# Altium project BLDC_DRIVER.PrjPcb
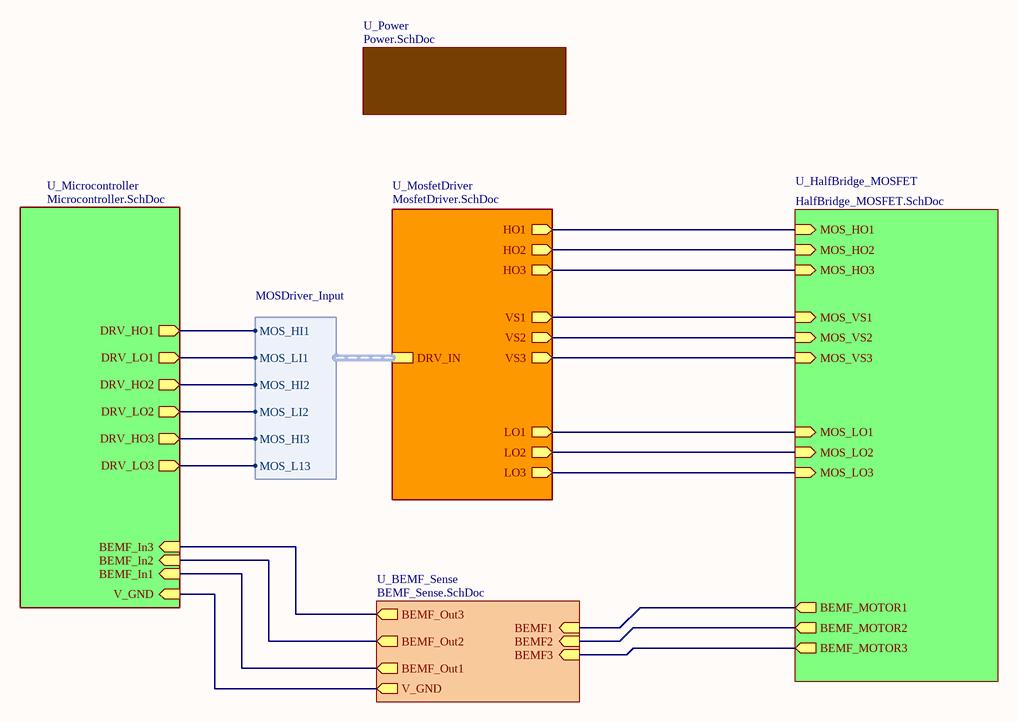
[diagram p0: TopLevel.SchDoc]
6 sheets, 81 parts. Net scope: hierarchical (ports join the sheet entries above them; power ports are global).
Board file: PCB1.PcbDoc
Sheets:
  TopLevel.SchDoc
    U_Microcontroller = Microcontroller.SchDoc
    U_MosfetDriver = MosfetDriver.SchDoc
    U_BEMF_Sense = BEMF_Sense.SchDoc
    U_Power = Power.SchDoc
    U_HalfBridge_MOSFET = HalfBridge_MOSFET.SchDoc

## Sheet TopLevel.SchDoc: TOP LEVEL
size A4

### Sub-sheets
U_BEMF_Sense = BEMF_Sense.SchDoc: BEMF_Out3 (out), BEMF_Out1 (out), BEMF_Out2 (out), BEMF1 (in), BEMF2 (in), BEMF3 (in), V_GND (out)
U_HalfBridge_MOSFET = HalfBridge_MOSFET.SchDoc: MOS_HO1 (in), MOS_VS1 (in), MOS_LO1 (in), BEMF_MOTOR1 (out), MOS_HO2 (in), MOS_VS2 (in), MOS_LO2 (in), BEMF_MOTOR2 (out), MOS_HO3 (in), MOS_VS3 (in), MOS_LO3 (in), BEMF_MOTOR3 (out)
U_Microcontroller = Microcontroller.SchDoc: DRV_HO1 (out), DRV_LO2 (out), DRV_LO1 (out), DRV_HO2 (out), DRV_LO3 (out), DRV_HO3 (out), BEMF_In3 (in), BEMF_In2 (in), BEMF_In1 (in), V_GND (in)
U_MosfetDriver = MosfetDriver.SchDoc: DRV_IN (harness MOSDriver_Input), LO1 (out), LO2 (out), LO3 (out), VS3 (out), VS2 (out), VS1 (out), HO3 (out), HO2 (out), HO1 (out)
U_Power = Power.SchDoc: no entries

### Harnesses
MOSDriver_Input: MOS_HI1, MOS_HI2, MOS_HI3, MOS_LI1, MOS_LI2, MOS_L13

### Nets
BEMF1: sheet U_MosfetDriver/VS1, sheet U_BEMF_Sense/BEMF1, sheet U_HalfBridge_MOSFET/MOS_VS1, sheet U_HalfBridge_MOSFET/BEMF_MOTOR1
BEMF2: sheet U_MosfetDriver/VS2, sheet U_BEMF_Sense/BEMF2, sheet U_HalfBridge_MOSFET/MOS_VS2, sheet U_HalfBridge_MOSFET/BEMF_MOTOR2
BEMF3: sheet U_MosfetDriver/VS3, sheet U_BEMF_Sense/BEMF3, sheet U_HalfBridge_MOSFET/MOS_VS3, sheet U_HalfBridge_MOSFET/BEMF_MOTOR3
BEMF_Out1: sheet U_Microcontroller/BEMF_In1, sheet U_BEMF_Sense/BEMF_Out1
BEMF_Out2: sheet U_Microcontroller/BEMF_In2, sheet U_BEMF_Sense/BEMF_Out2
BEMF_Out3: sheet U_Microcontroller/BEMF_In3, sheet U_BEMF_Sense/BEMF_Out3
HIN1: sheet U_Microcontroller/DRV_HO1, sheet U_MosfetDriver/DRV_IN.MOS_HI1
HIN2: sheet U_Microcontroller/DRV_HO2, sheet U_MosfetDriver/DRV_IN.MOS_HI2
HIN3: sheet U_Microcontroller/DRV_HO3, sheet U_MosfetDriver/DRV_IN.MOS_HI3
LIN1: sheet U_Microcontroller/DRV_LO1, sheet U_MosfetDriver/DRV_IN.MOS_LI1
LIN2: sheet U_Microcontroller/DRV_LO2, sheet U_MosfetDriver/DRV_IN.MOS_LI2
LIN3: sheet U_Microcontroller/DRV_LO3, sheet U_MosfetDriver/DRV_IN.MOS_L13
VGND: sheet U_Microcontroller/V_GND, sheet U_BEMF_Sense/V_GND
NetIC1_5: sheet U_MosfetDriver/LO1, sheet U_HalfBridge_MOSFET/MOS_LO1
NetIC1_7: sheet U_MosfetDriver/HO1, sheet U_HalfBridge_MOSFET/MOS_HO1
NetIC2_5: sheet U_MosfetDriver/LO2, sheet U_HalfBridge_MOSFET/MOS_LO2
NetIC2_7: sheet U_MosfetDriver/HO2, sheet U_HalfBridge_MOSFET/MOS_HO2
NetIC3_5: sheet U_MosfetDriver/LO3, sheet U_HalfBridge_MOSFET/MOS_LO3
NetIC3_7: sheet U_MosfetDriver/HO3, sheet U_HalfBridge_MOSFET/MOS_HO3

### Notes on the sheet
- Title
- Size:
- Date:
- A4
- Number:
- Time:
- Revision:
- Sheet
- of
- File:

## Sheet Microcontroller.SchDoc
size A4
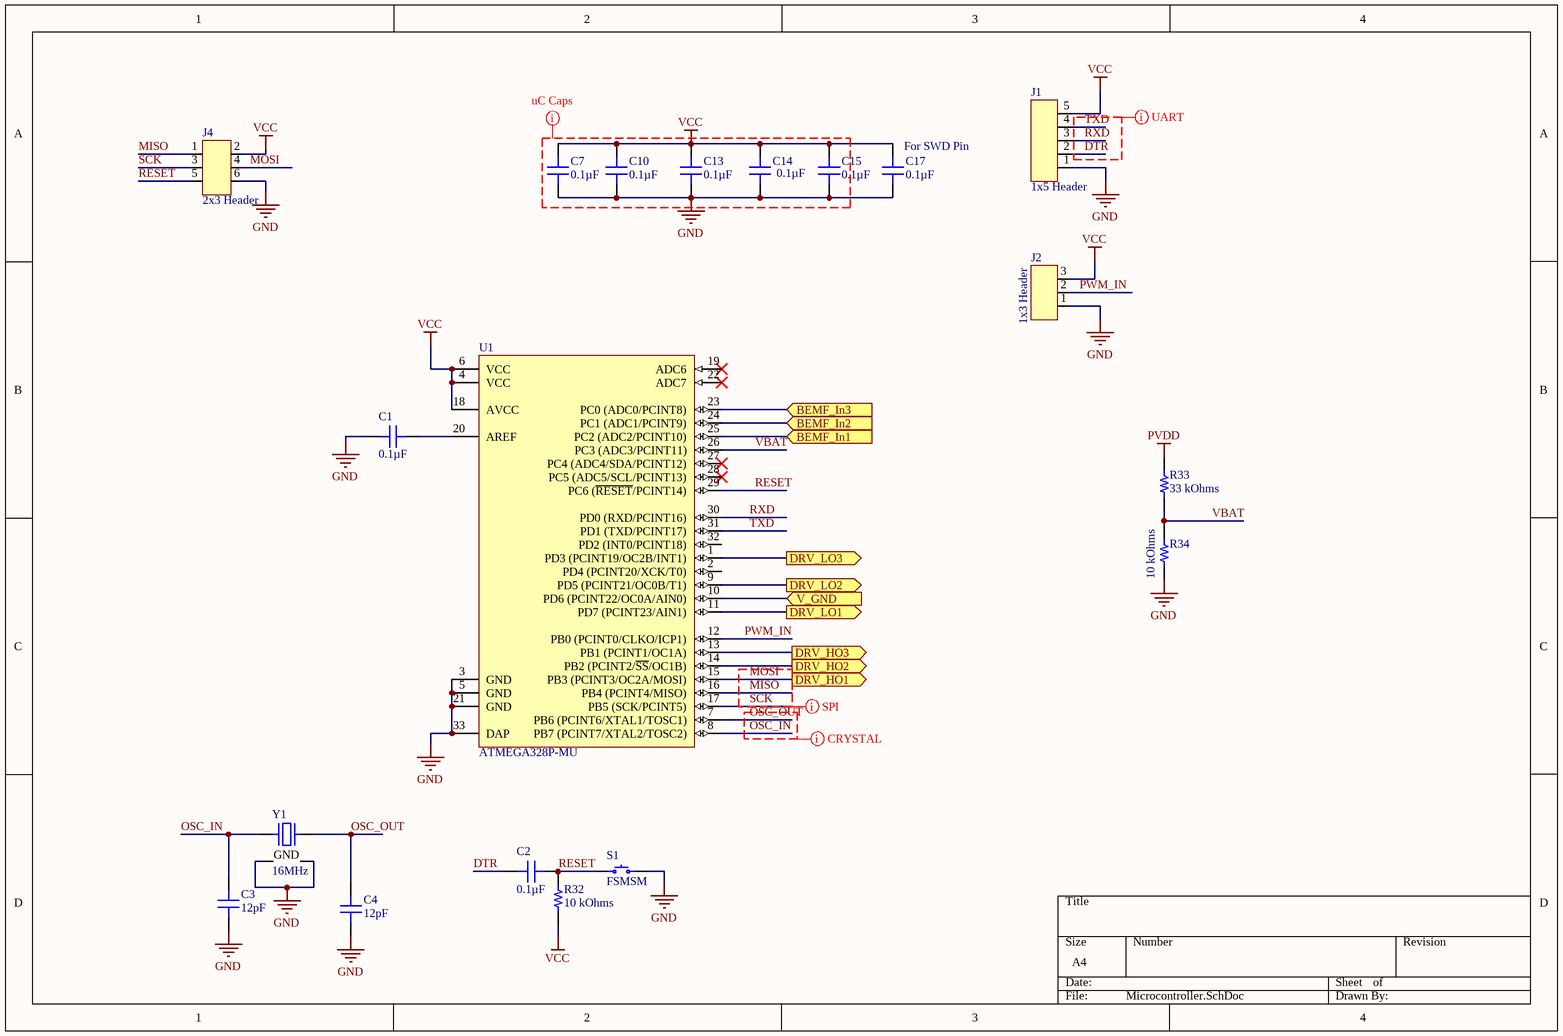
[diagram p1: Microcontroller.SchDoc]

### Parts
C1  0.1µF  [CAP 0603_1608]
C2  0.1µF  [CAP 0603_1608]
C3  12pF  [CAP 0402_1005]
C4  12pF  [CAP 0402_1005]
C7  0.1µF  [CAP 0603_1608]
C10  0.1µF  [CAP 0603_1608]
C13  0.1µF  [CAP 0603_1608]
C14  0.1µF  [CAP 0603_1608]
C15  0.1µF  [CAP 0603_1608]
C17  0.1µF  [CAP 0603_1608]
J1  1x5 Header  [1X5-HEADER]
J2  1x3 Header  [1x3Header]
J4  2x3 Header  [3x2 Header]
R32  10 kOhms  [RES 0805_2012]
R33  33 kOhms  [RES 0805_2012]
R34  10 kOhms  [RES 0805_2012]
S1  FSMSM  [TE FSMSMTR]
U1  ATMEGA328P-MU  [QFN50P500X500X100_HS-33N]
Y1  16MHz  [NDK NX2520SA]

### Ports
BEMF_In1 (in), BEMF_In2 (in), BEMF_In3 (in), DRV_HO1 (out), DRV_HO2 (out), DRV_HO3 (out), DRV_LO1 (out), DRV_LO2 (out), DRV_LO3 (out), V_GND (in)

### Nets
GND: C1.2 C3.1 C4.1 C7.1 C10.1 C13.1 C14.1 C15.1 C17.2 J1.1 J2.1 J4.6 R34.1 S1.2 U1.3(GND) U1.5(GND) U1.21(GND) U1.33(DAP) Y1.2(GND) Y1.4(GND)
PVDD: R33.2
VCC: C7.2 C10.2 C13.2 C14.2 C15.2 C17.1 J1.5 J2.3 J4.2 R32.2 U1.4(VCC) U1.6(VCC) U1.18(AVCC)
BEMF_Out1: U1.25(PC2_(ADC2/PCINT10)) ; port BEMF_In1
BEMF_Out2: U1.24(PC1_(ADC1/PCINT9)) ; port BEMF_In2
BEMF_Out3: U1.23(PC0_(ADC0/PCINT8)) ; port BEMF_In3
DTR: C2.2 J1.2
HIN2: U1.14(PB2_(PCINT2/~{SS}/OC1B)) ; port DRV_HO2
HIN3: U1.13(PB1_(PCINT1/OC1A)) ; port DRV_HO3
LIN1: U1.11(PD7_(PCINT23/AIN1)) ; port DRV_LO1
LIN2: U1.9(PD5_(PCINT21/OC0B/T1)) ; port DRV_LO2
LIN3: U1.1(PD3_(PCINT19/OC2B/INT1)) ; port DRV_LO3
MISO: J4.1 U1.16(PB4_(PCINT4/MISO))
MOSI: J4.4 U1.15(PB3_(PCINT3/OC2A/MOSI)) ; port DRV_HO1  [project net HIN1]
OSC_IN: C3.2 U1.8(PB7_(PCINT7/XTAL2/TOSC2)) Y1.1
OSC_OUT: C4.2 U1.7(PB6_(PCINT6/XTAL1/TOSC1)) Y1.3
PWM_IN: J2.2 U1.12(PB0_(PCINT0/CLKO/ICP1))
RESET: C2.1 J4.5 R32.1 S1.1 U1.29(PC6_(~{RESET}/PCINT14))
RXD: J1.3 U1.30(PD0_(RXD/PCINT16))
SCK: J4.3 U1.17(PB5_(SCK/PCINT5))
TXD: J1.4 U1.31(PD1_(TXD/PCINT17))
VBAT: R33.1 R34.2 U1.26(PC3_(ADC3/PCINT11))
VGND: U1.10(PD6_(PCINT22/OC0A/AIN0)) ; port V_GND
NetC1_1: C1.1 U1.20(AREF)

Not connected (* = marked no-connect by the designer): U1 2(PD4_(PCINT20/XCK/T0)) 19(ADC6)* 22(ADC7)* 27(PC4_(ADC4/SDA/PCINT12))* 28(PC5_(ADC5/SCL/PCINT13))* 32(PD2_(INT0/PCINT18))

### Layout directives
Object Class: uC: GND, VCC
net class Programming Pins: DTR, RXD, TXD
net class SPI Pins: SCK
net class Crystal Pinsw: OSC_IN, OSC_OUT

### Notes on the sheet
- (near C17) For SWD Pin

### Library data of the parts
C1 C2 C7 C10 C13-C15 C17 = CML0603X7R104KT50V: CAP CER 0.1UF 50V X7R 0603; Manufacturer: Stackpole Electronics Inc; Tolerance: ±10%; Part Number: CML0603X7R104KT50V; Value: 0.1µF; Applications: General Purpose; Capacitance: 0.1µF; ComponentLink1Description: Datasheet; ComponentLink1URL: http://www.seielect.com/Catalog/SEI-CML.PDF; ComponentLink2Description: DigiKey Link; ComponentLink2URL: http://digikey.com/product-detail/en/stackpole-electronics-inc/CML0603X7R104KT50V/738-CML0603X7R104KT50VCT-ND/10660220; Device Package: 0603 (1608 Metric); LastUpdated: 2.9.2020 01:03:28; Lifecycle Status: Active; Minimum Order: 1; Mounting Type: Surface Mount, MLCC; Operating Temperature: -55°C ~ 125°C; Package / Case: 0603 (1608 Metric); Packaging: Unknown; PartId: 26324; Part Status: Active; Price: 0.01; Series: CML_X7R; Supplier 1: DigiKey; Supplier Part Number 1: 738-CML0603X7R104KT50VCT-ND; Temperature Coefficient: X7R; Voltage - Rated: 50V
C3 C4 = 04025U120GAT2A: CAP CER 12PF 50V NP0 0402; Manufacturer: AVX Corporation; Temperature Coefficient: C0G, NP0; Tolerance: ±2%; Part Number: 04025U120GAT2A; Value: 12pF; Applications: RF, Microwave, High Frequency; Capacitance: 12pF; ComponentLink1Description: Datasheet; ComponentLink1URL: http://datasheets.avx.com/U-Series.pdf; ComponentLink2Description: DigiKey Link; ComponentLink2URL: http://digikey.com/product-detail/en/avx-corporation/04025U120GAT2A/478-10137-1-ND/6797158; Device Package: 0402 (1005 Metric); Features: Ultra Low ESR; LastUpdated: 2.9.2020 01:01:29; Lifecycle Status: Active; Minimum Order: 1; Mounting Type: Surface Mount, MLCC; Operating Temperature: -55°C ~ 125°C; Package / Case: 0402 (1005 Metric); Packaging: TapeAndReel; PartId: 12930; Part Status: Active; Price: 0.05; Series: U; Size / Dimension: 0.039" L x 0.020" W (1.00mm x 0.50mm); Supplier 1: DigiKey; Supplier Part Number 1: 478-10137-1-ND; Thickness (Max): 0.022" (0.55mm); Voltage - Rated: 50V
J1 = 1x5 Header: 1X5 Male Header 2.54mm
J2 = 1x3 Header: 1x3 Male Header 2.54mm
J4 = 2x3 Header: 2x3 Male Header 2.54mm
R32 = CRT0805-BY-1002EST: RESTHINFILM 0805 10K0 0.1% 125MW; Manufacturer: Bourns Inc.; Power (Watts): 0.125W, 1/8W; Temperature Coefficient: ±25ppm/°C; Part Number: CRT0805-BY-1002EST; Value: 10 kOhms; ComponentLink1Description: Datasheet; ComponentLink1URL: https://www.bourns.com/docs/Product-Datasheets/CRT-ST.pdf; ComponentLink2Description: DigiKey Link; ComponentLink2URL: http://digikey.com/product-detail/en/bourns-inc/CRT0805-BY-1002EST/CRT0805-BY-1002ESTCT-ND/7928093; Composition: Thin Film; Device Package: 0805 (2012 Metric); Features: Current Sense; Height - Seated (Max): 0.024" (0.60mm); LastUpdated: 2.9.2020 01:14:26; Lifecycle Status: Active; Minimum Order: 1; Number of Terminations: 2; Operating Temperature: -55°C ~ 155°C; Package / Case: 0805 (2012 Metric); Packaging: TapeAndReel; PartId: 49388; Part Status: Active; Price: 0.04; Resistance: 10 kOhms; Series: CRT-ST; Size / Dimension: 0.079" L x 0.049" W (2.00mm x 1.25mm); Supplier 1: DigiKey; Supplier Part Number 1: CRT0805-BY-1002ESTCT-ND; Supplier Device Package: 0805; Tolerance: ±0.1%
R33 = CR0805-FX-3302ELF: RES SMD 33K OHM 1% 1/8W 0805; Manufacturer: Bourns Inc.; Power (Watts): 0.125W, 1/8W; Temperature Coefficient: ±100ppm/°C; Part Number: CR0805-FX-3302ELF; Value: 33 kOhms; ComponentLink1Description: Datasheet; ComponentLink1URL: https://www.bourns.com/docs/Product-Datasheets/CHPREZTR.pdf; ComponentLink2Description: DigiKey Link; ComponentLink2URL: http://digikey.com/product-detail/en/bourns-inc/CR0805-FX-3302ELF/CR0805-FX-3302ELFCT-ND/4247928; Composition: Thick Film; Device Package: 0805 (2012 Metric); Features: Moisture Resistant; Height - Seated (Max): 0.024" (0.60mm); LastUpdated: 2.9.2020 01:14:29; Lifecycle Status: Active; Minimum Order: 1; Number of Terminations: 2; Operating Temperature: -55°C ~ 155°C; Package / Case: 0805 (2012 Metric); Packaging: TapeAndReel; PartId: 48969; Part Status: Active; Price: 0.01; Resistance: 33 kOhms; Series: CR0805; Size / Dimension: 0.079" L x 0.049" W (2.00mm x 1.25mm); Supplier 1: DigiKey; Supplier Part Number 1: CR0805-FX-3302ELFCT-ND; Supplier Device Package: 0805; Tolerance: ±1%
R34 = RN73R2ATTD1002F25: RES 10K OHM 1% 1/8W 0805; Manufacturer: KOA Speer Electronics, Inc.; Power (Watts): 0.125W, 1/8W; Temperature Coefficient: ±25ppm/°C; Part Number: RN73R2ATTD1002F25; Value: 10 kOhms; ComponentLink1Description: Datasheet; ComponentLink1URL: //media.digikey.com/pdf/Data%20Sheets/KOA%20Speer/RN73R_Type_DS.pdf; ComponentLink2Description: DigiKey Link; ComponentLink2URL: http://digikey.com/product-detail/en/koa-speer-electronics-inc/RN73R2ATTD1002F25/2019-RN73R2ATTD1002F25CT-ND/11476953; Composition: Metal Film; Device Package: 0805 (2012 Metric); Features: Moisture Resistant; LastUpdated: 2.9.2020 01:14:23; Lifecycle Status: Active; Minimum Order: 1; Number of Terminations: 2; Operating Temperature: -55°C ~ 155°C; Package / Case: 0805 (2012 Metric); Packaging: TapeAndReel; PartId: 50100; Part Status: Active; Price: 0.06; Resistance: 10 kOhms; Series: RN73R; Supplier 1: DigiKey; Supplier Part Number 1: 2019-RN73R2ATTD1002F25CT-ND; Supplier Device Package: 0805; Tolerance: ±1%
S1 = FSMSM: SWITCH TACTILE SPST-NO 0.05A 24V; Manufacturer: TE Connectivity ALCOSWITCH Switches; Actuator Height off PCB, Vertical: 4.57mm; Actuator Orientation: Top Actuated; Actuator Type: Standard; Contact Rating @ Voltage: 0.05A @ 24VDC; Illumination: Non-Illuminated; Operating Force: 180gf; Outline: 6.00mm x 3.50mm; Switch Function: Off-Mom; Part Number: FSMSM; Circuit: SPST-NO; ComponentLink1Description: Datasheet; ComponentLink1URL: https://www.te.com/commerce/DocumentDelivery/DDEController?Action=srchrtrv&DocNm=1437566-3&DocType=Customer+Drawing&DocLang=English; ComponentLink2Description: DigiKey Link; ComponentLink2URL: http://digikey.com/product-detail/en/te-connectivity-alcoswitch-switches/FSMSM/450-1140-ND/525812; LastUpdated: 2.9.2020 01:27:08; Lifecycle Status: Active; Minimum Order: 1; Mounting Type: Surface Mount; Operating Temperature: -35°C ~ 85°C; Packaging: Bulk; Part Status: Active; Price: 0.27; Series: FSMSM; Supplier 1: DigiKey; Supplier Part Number 1: 450-1140-ND; Termination Style: Gull Wing
U1 = ATMEGA328P-MU: 8-bit AVR Microcontroller, 32KB Flash, 1KB EEPROM, 2KB SRAM, 32-pin MLF, Industrial Grade (-40°C to 85°C); Code_JEDEC: MO-220-VHHD-2; PackageVersion: revE, May-2006; DatasheetVersion: revA, Jan-2010; PackageDescription: 32-Pin Micro Lead Frame Package (MLF),  5 x 5 x 1.0 mm Body, Pitch 0.50 mm, 3.10mm Exposed Pad; PackageReference: 32M1-A; PartNumber: ATMEGA328P-MU
Y1 = NX2520SA-16MHZ-EXS00A-CS11340: CRYSTAL 16MHZ 8PF SMD; Manufacturer: NDK America, Inc.; ESR (Equivalent Series Resistance): 80 Ohms; Frequency Stability: ±15ppm; Operating Mode: Fundamental; Part Number: NX2520SA-16MHZ-EXS00A-CS11340; ComponentLink1Description: Datasheet; ComponentLink1URL: //media.digikey.com/pdf/Data%20Sheets/NDK%20PDFs/NX2520SA-16MHz-EXS00A-CS11340.pdf; ComponentLink2Description: DigiKey Link; ComponentLink2URL: http://digikey.com/product-detail/en/ndk-america-inc/NX2520SA-16MHZ-EXS00A-CS11340/644-1327-1-ND/8275445; Frequency: 16MHz; Frequency Tolerance: ±15ppm; Height - Seated (Max): 0.022" (0.55mm); LastUpdated: 2.9.2020 01:21:57; Lifecycle Status: Active; Load Capacitance: 8pF; Minimum Order: 1; Mounting Type: Surface Mount; Operating Temperature: -10°C ~ 70°C; Package / Case: 4-SMD, No Lead; Packaging: TapeAndReel; PartId: 525; Part Status: Active; Price: 0.73; Series: NX2520SA; Size / Dimension: 0.098" L x 0.079" W (2.50mm x 2.00mm); Supplier 1: DigiKey; Supplier Part Number 1: 644-1327-1-ND; Type: MHz Crystal; Value: 16MHz

## Sheet MosfetDriver.SchDoc
size A4
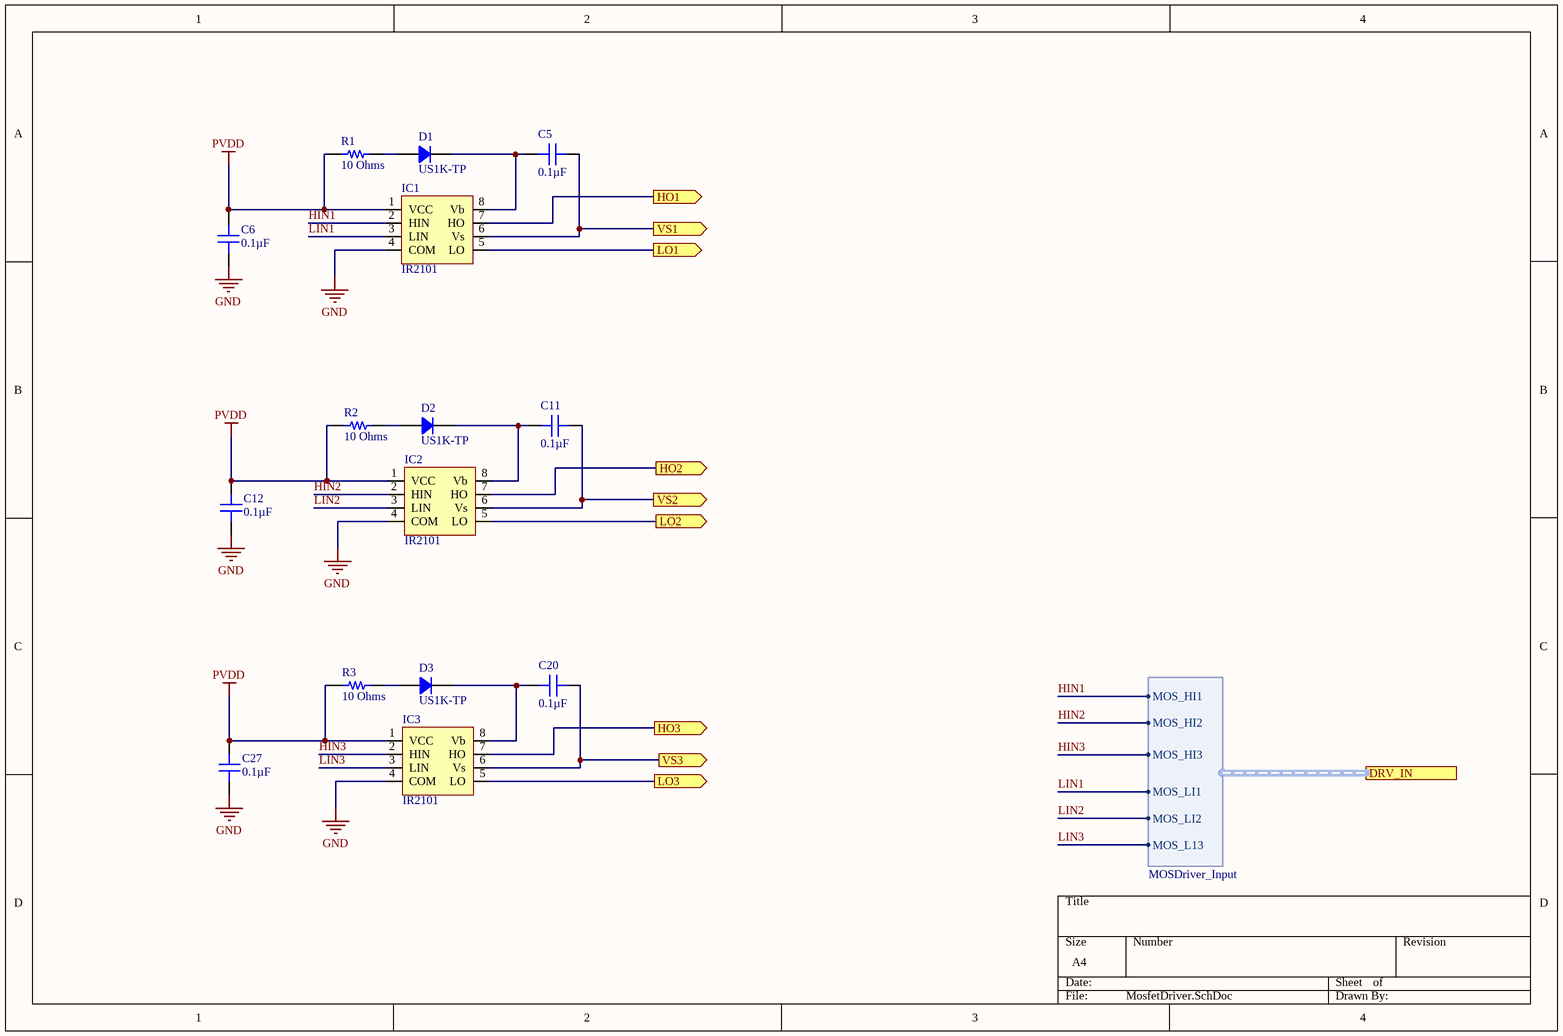
[diagram p2: MosfetDriver.SchDoc]

### Parts
C5  0.1µF  [CAP 0805_2012]
C6  0.1µF  [CAP 0805_2012]
C11  0.1µF  [CAP 0805_2012]
C12  0.1µF  [CAP 0805_2012]
C20  0.1µF  [CAP 0805_2012]
C27  0.1µF  [CAP 0805_2012]
D1  US1K-TP  [DO214AC SMA]
D2  US1K-TP  [DO214AC SMA]
D3  US1K-TP  [DO214AC SMA]
IC1  IR2101  [SOIC8]
IC2  IR2101  [SOIC8]
IC3  IR2101  [SOIC8]
R1  10 Ohms  [RES 0805_2012]
R2  10 Ohms  [RES 0805_2012]
R3  10 Ohms  [RES 0805_2012]

### Ports
DRV_IN (harness MOSDriver_Input), HO1 (out), HO2 (out), HO3 (out), LO1 (out), LO2 (out), LO3 (out), VS1 (out), VS2 (out), VS3 (out)

### Harnesses
MOSDriver_Input: MOS_HI1, MOS_HI2, MOS_HI3, MOS_LI1, MOS_LI2, MOS_L13

### Nets
GND: C6.1 C12.1 C27.1 IC1.4(COM) IC2.4(COM) IC3.4(COM)
PVDD: C6.2 C12.2 C27.2 IC1.1(VCC) IC2.1(VCC) IC3.1(VCC) R1.1 R2.1 R3.1
BEMF1: C5.1 IC1.6(Vs) ; port VS1
BEMF2: C11.1 IC2.6(Vs) ; port VS2
BEMF3: C20.1 IC3.6(Vs) ; port VS3
HIN1: IC1.2(HIN) ; port DRV_IN.MOS_HI1
HIN2: IC2.2(HIN) ; port DRV_IN.MOS_HI2
HIN3: IC3.2(HIN) ; port DRV_IN.MOS_HI3
LIN1: IC1.3(LIN) ; port DRV_IN.MOS_LI1
LIN2: IC2.3(LIN) ; port DRV_IN.MOS_LI2
LIN3: IC3.3(LIN) ; port DRV_IN.MOS_L13
NetC5_2: C5.2 D1.2 IC1.8(Vb)
NetC11_2: C11.2 D2.2 IC2.8(Vb)
NetC20_2: C20.2 D3.2 IC3.8(Vb)
NetD1_1: D1.1 R1.2
NetD2_1: D2.1 R2.2
NetD3_1: D3.1 R3.2
NetIC1_5: IC1.5(LO) ; port LO1
NetIC1_7: IC1.7(HO) ; port HO1
NetIC2_5: IC2.5(LO) ; port LO2
NetIC2_7: IC2.7(HO) ; port HO2
NetIC3_5: IC3.5(LO) ; port LO3
NetIC3_7: IC3.7(HO) ; port HO3

### Library data of the parts
C5 C6 C11 C12 C20 C27 = CML0805X7R104KT50V: CAP CER 0.1UF 50V X7R 0805; Manufacturer: Stackpole Electronics Inc; Tolerance: ±10%; Part Number: CML0805X7R104KT50V; Value: 0.1µF; Applications: General Purpose; Capacitance: 0.1µF; ComponentLink1Description: Datasheet; ComponentLink1URL: http://www.seielect.com/Catalog/SEI-CML.PDF; ComponentLink2Description: DigiKey Link; ComponentLink2URL: http://digikey.com/product-detail/en/stackpole-electronics-inc/CML0805X7R104KT50V/738-CML0805X7R104KT50VCT-ND/10660126; Device Package: 0805 (2012 Metric); LastUpdated: 2.9.2020 01:04:17; Lifecycle Status: Active; Minimum Order: 1; Mounting Type: Surface Mount, MLCC; Operating Temperature: -55°C ~ 125°C; Package / Case: 0805 (2012 Metric); Packaging: Unknown; PartId: 26478; Part Status: Active; Price: 0.02; Series: CML_X7R; Supplier 1: DigiKey; Supplier Part Number 1: 738-CML0805X7R104KT50VCT-ND; Temperature Coefficient: X7R; Voltage - Rated: 50V
D1-D3 = US1K-TP: DIODE GEN PURP 800V 1A DO214AC; Manufacturer: Micro Commercial Co; Capacitance @ Vr, F: 10pF @ 4V, 1MHz; Current - Reverse Leakage @ Vr: 10µA @ 800V; Diode Type: Standard; Reverse Recovery Time (trr): 75ns; Speed: Fast Recovery =< 500ns, > 200mA (Io); Voltage - Forward (Vf) (Max) @ If: 1.7V @ 1A; Part Number: US1K-TP; ComponentLink1Description: Datasheet; ComponentLink1URL: https://www.mccsemi.com/pdf/Products/US1A-US1M(DO-214AC).pdf; ComponentLink2Description: DigiKey Link; ComponentLink2URL: http://digikey.com/product-detail/en/micro-commercial-co/US1K-TP/US1K-TPMSCT-ND/1793442; Current - Average Rectified (Io): 1A; LastUpdated: 2.9.2020 01:19:02; Lifecycle Status: Active; Minimum Order: 1; Mounting Type: Surface Mount; Operating Temperature - Junction: -65°C ~ 175°C; Package / Case: DO-214AC, SMA; Packaging: TapeAndReel; PartId: 887; Part Status: Active; Price: 0.08; Series: -; Supplier 1: DigiKey; Supplier Part Number 1: US1K-TPMSCT-ND; Supplier Device Package: DO-214AC (SMA); Voltage - DC Reverse (Vr) (Max): 800V
IC1-IC3 = IR2101: IC-2101 HIGH-LOW DRIVER SOP8 IR
R1-R3 = RK73H2ATTD10R0F: RES 10 OHM 1% 1/4W 0805; Manufacturer: KOA Speer Electronics, Inc.; Power (Watts): 0.25W, 1/4W; Temperature Coefficient: ±100ppm/°C; Part Number: RK73H2ATTD10R0F; Value: 10 Ohms; ComponentLink1Description: Datasheet; ComponentLink1URL: http://www.koaspeer.com/catimages/Products/RK73H/RK73H.pdf; ComponentLink2Description: DigiKey Link; ComponentLink2URL: http://digikey.com/product-detail/en/koa-speer-electronics-inc/RK73H2ATTD10R0F/2019-RK73H2ATTD10R0FCT-ND/10234529; Composition: Thick Film; Device Package: 0805 (2012 Metric); Features: Automotive AEC-Q200, Moisture Resistant; Height - Seated (Max): 0.024" (0.60mm); LastUpdated: 2.9.2020 01:15:00; Lifecycle Status: Active; Minimum Order: 1; Number of Terminations: 2; Operating Temperature: -55°C ~ 155°C; Package / Case: 0805 (2012 Metric); Packaging: CutTape; PartId: 38358; Part Status: Active; Price: 0.10; Ratings: AEC-Q200; Resistance: 10 Ohms; Series: RK73H; Size / Dimension: 0.079" L x 0.049" W (2.00mm x 1.25mm); Supplier 1: DigiKey; Supplier Part Number 1: 2019-RK73H2ATTD10R0FCT-ND; Supplier Device Package: 0805; Tolerance: ±1%

## Sheet BEMF_Sense.SchDoc
size A4
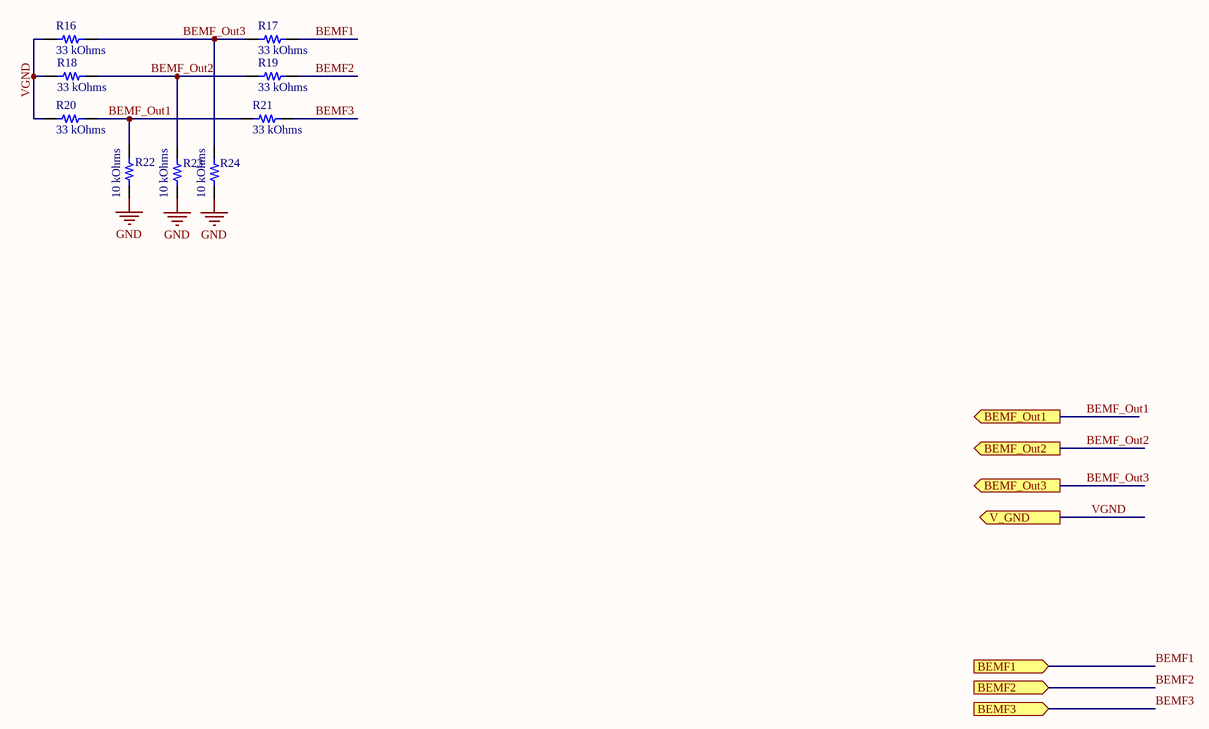
[diagram p3: BEMF_Sense.SchDoc]

### Parts
R16  33 kOhms  [RES 0805_2012]
R17  33 kOhms  [RES 0805_2012]
R18  33 kOhms  [RES 0805_2012]
R19  33 kOhms  [RES 0805_2012]
R20  33 kOhms  [RES 0805_2012]
R21  33 kOhms  [RES 0805_2012]
R22  10 kOhms  [RES 0805_2012]
R23  10 kOhms  [RES 0805_2012]
R24  10 kOhms  [RES 0805_2012]

### Ports
BEMF1 (in), BEMF2 (in), BEMF3 (in), BEMF_Out1 (out), BEMF_Out2 (out), BEMF_Out3 (out), V_GND (out)

### Nets
GND: R22.1 R23.1 R24.1
BEMF1: R17.2 ; port BEMF1
BEMF2: R19.2 ; port BEMF2
BEMF3: R21.2 ; port BEMF3
BEMF_Out1: R20.2 R21.1 R22.2 ; port BEMF_Out1
BEMF_Out2: R18.2 R19.1 R23.2 ; port BEMF_Out2
BEMF_Out3: R16.2 R17.1 R24.2 ; port BEMF_Out3
VGND: R16.1 R18.1 R20.1 ; port V_GND

### Library data of the parts
R16-R21 = CR0805-FX-3302ELF: as R33 on sheet Microcontroller; Part Number: CR0805-FX-3302ELF; Value: 33 kOhms; ComponentLink1Description: Datasheet; ComponentLink1URL: https://www.bourns.com/docs/Product-Datasheets/CHPREZTR.pdf; ComponentLink2Description: DigiKey Link; ComponentLink2URL: http://digikey.com/product-detail/en/bourns-inc/CR0805-FX-3302ELF/CR0805-FX-3302ELFCT-ND/4247928; Composition: Thick Film; Device Package: 0805 (2012 Metric); Features: Moisture Resistant; Height - Seated (Max): 0.024" (0.60mm); LastUpdated: 2.9.2020 01:14:29; Lifecycle Status: Active; Minimum Order: 1; Number of Terminations: 2; Operating Temperature: -55°C ~ 155°C; Package / Case: 0805 (2012 Metric); Packaging: TapeAndReel; PartId: 48969; Part Status: Active; Price: 0.01; Resistance: 33 kOhms; Series: CR0805; Size / Dimension: 0.079" L x 0.049" W (2.00mm x 1.25mm); Supplier 1: DigiKey; Supplier Part Number 1: CR0805-FX-3302ELFCT-ND; Supplier Device Package: 0805; Tolerance: ±1%
R22-R24 = RN73R2ATTD1002F25: as R34 on sheet Microcontroller; Part Number: RN73R2ATTD1002F25; Value: 10 kOhms; ComponentLink1Description: Datasheet; ComponentLink1URL: //media.digikey.com/pdf/Data%20Sheets/KOA%20Speer/RN73R_Type_DS.pdf; ComponentLink2Description: DigiKey Link; ComponentLink2URL: http://digikey.com/product-detail/en/koa-speer-electronics-inc/RN73R2ATTD1002F25/2019-RN73R2ATTD1002F25CT-ND/11476953; Composition: Metal Film; Device Package: 0805 (2012 Metric); Features: Moisture Resistant; LastUpdated: 2.9.2020 01:14:23; Lifecycle Status: Active; Minimum Order: 1; Number of Terminations: 2; Operating Temperature: -55°C ~ 155°C; Package / Case: 0805 (2012 Metric); Packaging: TapeAndReel; PartId: 50100; Part Status: Active; Price: 0.06; Resistance: 10 kOhms; Series: RN73R; Supplier 1: DigiKey; Supplier Part Number 1: 2019-RN73R2ATTD1002F25CT-ND; Supplier Device Package: 0805; Tolerance: ±1%

## Sheet Power.SchDoc
size A4
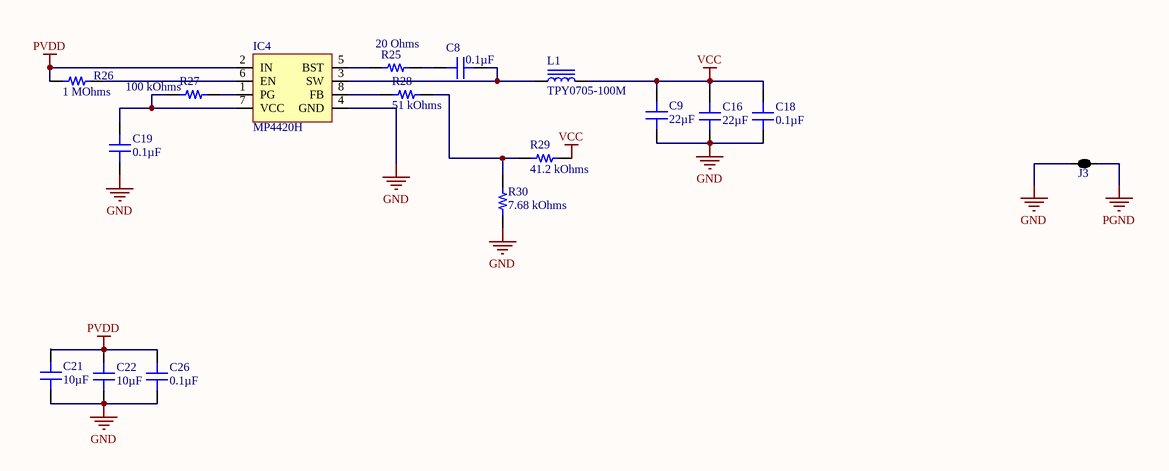
[diagram p4: Power.SchDoc]

### Parts
C8  0.1µF  [CAP 0603_1608]
C9  22µF  [CAP 1210_3225 - 1MM]
C16  22µF  [CAP 1210_3225 - 1MM]
C18  0.1µF  [CAP 0603_1608]
C19  0.1µF  [CAP 0603_1608]
C21  10µF  [CAP 1210_3225 - 1.8MM]
C22  10µF  [CAP 1210_3225 - 1.8MM]
C26  0.1µF  [CAP 0603_1608]
IC4  MP4420H  [TSOT23-8]
J3  2 way net tie junction  [2way_HP]  (value not drawn)  (net tie, no BOM)
L1  TPY0705-100M  [INDP6868X46N]
R25  20 Ohms  [RES 0603_1608]
R26  1 MOhms  [RES 0603_1608]
R27  100 kOhms  [RES 0603_1608]
R28  51 kOhms  [RES 0805_2012]
R29  41.2 kOhms  [RES 0805_2012]
R30  7.68 kOhms  [RES 0805_2012]

### Nets
GND: C9.1 C16.1 C18.1 C19.1 C21.1 C22.1 C26.1 IC4.4(GND) J3.1 R30.1
PGND: J3.2
PVDD: C21.2 C22.2 C26.2 IC4.2(IN) R26.1
VCC: C9.2 C16.2 C18.2 L1.2 R29.2
NetC8_1: C8.1 R25.2
NetC8_2: C8.2 IC4.3(SW) L1.1
NetC19_2: C19.2 IC4.7(VCC) R27.1
NetIC4_1: IC4.1(PG) R27.2
NetIC4_5: IC4.5(BST) R25.1
NetIC4_6: IC4.6(EN) R26.2
NetIC4_8: IC4.8(FB) R28.1
NetR28_2: R28.2 R29.1 R30.2

### Library data of the parts
C8 C18 C19 C26 = CML0603X7R104KT50V: as C1 on sheet Microcontroller; Part Number: CML0603X7R104KT50V; Value: 0.1µF; Applications: General Purpose; Capacitance: 0.1µF; ComponentLink1Description: Datasheet; ComponentLink1URL: http://www.seielect.com/Catalog/SEI-CML.PDF; ComponentLink2Description: DigiKey Link; ComponentLink2URL: http://digikey.com/product-detail/en/stackpole-electronics-inc/CML0603X7R104KT50V/738-CML0603X7R104KT50VCT-ND/10660220; Device Package: 0603 (1608 Metric); LastUpdated: 2.9.2020 01:03:28; Lifecycle Status: Active; Minimum Order: 1; Mounting Type: Surface Mount, MLCC; Operating Temperature: -55°C ~ 125°C; Package / Case: 0603 (1608 Metric); Packaging: Unknown; PartId: 26324; Part Status: Active; Price: 0.01; Series: CML_X7R; Supplier 1: DigiKey; Supplier Part Number 1: 738-CML0603X7R104KT50VCT-ND; Temperature Coefficient: X7R; Voltage - Rated: 50V
C9 C16 = EMK325BJ226MD-T: CAP CER 22UF 16V X5R 1210; Manufacturer: Taiyo Yuden; Tolerance: ±20%; Part Number: EMK325BJ226MD-T; Value: 22µF; Applications: General Purpose; Capacitance: 22µF; ComponentLink1Description: Datasheet; ComponentLink1URL: https://ds.yuden.co.jp/TYCOMPAS/ut/detail?pn=EMK325BJ226MD-T  &u=M; ComponentLink2Description: DigiKey Link; ComponentLink2URL: http://digikey.com/product-detail/en/taiyo-yuden/EMK325BJ226MD-T/587-2412-1-ND/2230278; Device Package: 1210 (3225 Metric); LastUpdated: 2.9.2020 01:10:27; Lifecycle Status: Active; Minimum Order: 1; Mounting Type: Surface Mount, MLCC; Operating Temperature: -55°C ~ 85°C; Package / Case: 1210 (3225 Metric); Packaging: TapeAndReel; PartId: 25269; Part Status: Active; Price: 0.25; Series: M; Size / Dimension: 0.126" L x 0.098" W (3.20mm x 2.50mm); Supplier 1: DigiKey; Supplier Part Number 1: 587-2412-1-ND; Temperature Coefficient: X5R; Thickness (Max): 0.037" (0.95mm); Voltage - Rated: 16V
C21 C22 = 1210BW106K500NGX110T: CAP CER 10UF 50V X5R 1210; Manufacturer: Knowles Novacap; Tolerance: ±10%; Part Number: 1210BW106K500NGX110T; Value: 10µF; Applications: General Purpose; Capacitance: 10µF; ComponentLink1Description: Datasheet; ComponentLink1URL: https://www.knowlescapacitors.com/getattachment/6c8d48ef-fc2b-4752-ae2c-ce6c208de0c4/High-Capacitance-Chip.aspx; ComponentLink2Description: DigiKey Link; ComponentLink2URL: http://digikey.com/product-detail/en/knowles-novacap/1210BW106K500NGX110T/1763-1137-1-ND/7304036; Device Package: 1210 (3225 Metric); Features: Gold Flash Termination; LastUpdated: 2.9.2020 01:10:35; Lifecycle Status: Active; Minimum Order: 1; Mounting Type: Surface Mount, MLCC; Operating Temperature: -55°C ~ 85°C; Package / Case: 1210 (3225 Metric); Packaging: TapeAndReel; PartId: 24853; Part Status: Active; Price: 5.15; Series: -; Size / Dimension: 0.125" L x 0.100" W (3.18mm x 2.54mm); Supplier 1: DigiKey; Supplier Part Number 1: 1763-1137-1-ND; Temperature Coefficient: X5R; Thickness (Max): 0.065" (1.65mm); Voltage - Rated: 50V
IC4 = MP4420H: V.REG.2A 3.8V-36V STEP-DOW TSOT-23-8
J3 = 2way: ComponentLink1URL: http://www.edatools.cz/addons; ComponentLink1Description: Source; FootprintNote: LP=12mil, MP=40mil, HP=120mil
L1 = TPY0705-100M: INDUCTOR FIXED 10UH 7X7MM SMD
R25 = CRCW060320R0FKEB: RES SMD 20 OHM 1% 1/10W 0603; Manufacturer: Vishay Dale; Power (Watts): 0.1W, 1/10W; Temperature Coefficient: ±100ppm/°C; Part Number: CRCW060320R0FKEB; Value: 20 Ohms; ComponentLink1Description: Datasheet; ComponentLink1URL: http://www.vishay.com/docs/20035/dcrcwe3.pdf; ComponentLink2Description: DigiKey Link; ComponentLink2URL: http://digikey.com/product-detail/en/vishay-dale/CRCW060320R0FKEB/541-CRCW060320R0FKEBCT-ND/11500739; Composition: Thick Film; Device Package: 0603 (1608 Metric); Features: Automotive AEC-Q200; LastUpdated: 2.9.2020 01:09:23; Lifecycle Status: Active; Minimum Order: 1; Number of Terminations: 2; Operating Temperature: -55°C ~ 155°C; Package / Case: 0603 (1608 Metric); Packaging: Unknown; PartId: 56605; Price: 0.10; Ratings: AEC-Q200; Resistance: 20 Ohms; Series: CRCW; Supplier 1: DigiKey; Supplier Part Number 1: 541-CRCW060320R0FKEBCT-ND; Supplier Device Package: 0603; Tolerance: ±1%
R26 = KTR03EZPJ105: RES SMD 1M OHM 5% 1/10W 0603; Manufacturer: Rohm Semiconductor; Power (Watts): 0.1W, 1/10W; Temperature Coefficient: ±200ppm/°C; Part Number: KTR03EZPJ105; Value: 1 MOhms; ComponentLink1Description: Datasheet; ComponentLink1URL: https://www.rohm.com/datasheet/KTR03EZPF/ktr-e; ComponentLink2Description: DigiKey Link; ComponentLink2URL: http://digikey.com/product-detail/en/rohm-semiconductor/KTR03EZPJ105/RHM1.0MAZCT-ND/2290033; Composition: Thick Film; Device Package: 0603 (1608 Metric); Features: Automotive AEC-Q200, High Voltage; Height - Seated (Max): 0.022" (0.55mm); LastUpdated: 2.9.2020 01:09:32; Lifecycle Status: Active; Minimum Order: 1; Number of Terminations: 2; Operating Temperature: -55°C ~ 155°C; Package / Case: 0603 (1608 Metric); Packaging: TapeAndReel; PartId: 25545; Part Status: Active; Price: 0.01; Ratings: AEC-Q200; Resistance: 1 MOhms; Series: KTR; Size / Dimension: 0.063" L x 0.031" W (1.60mm x 0.80mm); Supplier 1: DigiKey; Supplier Part Number 1: RHM1.0MAZCT-ND; Supplier Device Package: 0603; Tolerance: ±5%
R27 = CR0603-JW-104ELF: RES SMD 100K OHM 5% 1/10W 0603; Manufacturer: Bourns Inc.; Power (Watts): 0.1W, 1/10W; Temperature Coefficient: ±200ppm/°C; Part Number: CR0603-JW-104ELF; Value: 100 kOhms; ComponentLink1Description: Datasheet; ComponentLink1URL: https://www.bourns.com/docs/Product-Datasheets/CHPREZTR.pdf; ComponentLink2Description: DigiKey Link; ComponentLink2URL: http://digikey.com/product-detail/en/bourns-inc/CR0603-JW-104ELF/CR0603-JW-104ELFCT-ND/3767631; Composition: Thick Film; Device Package: 0603 (1608 Metric); Features: Moisture Resistant; Height - Seated (Max): 0.022" (0.55mm); LastUpdated: 2.9.2020 01:09:31; Lifecycle Status: Active; Minimum Order: 1; Number of Terminations: 2; Operating Temperature: -55°C ~ 155°C; Package / Case: 0603 (1608 Metric); Packaging: CutTape; PartId: 25661; Part Status: Active; Price: 0.10; Resistance: 100 kOhms; Series: CR0603; Size / Dimension: 0.063" L x 0.031" W (1.60mm x 0.80mm); Supplier 1: DigiKey; Supplier Part Number 1: CR0603-JW-104ELFCT-ND; Supplier Device Package: 0603; Tolerance: ±5%
R28 = RN73R2ATTD5102B25: RES 51K OHM 0.1% 1/8W 0805; Manufacturer: KOA Speer Electronics, Inc.; Power (Watts): 0.125W, 1/8W; Temperature Coefficient: ±25ppm/°C; Part Number: RN73R2ATTD5102B25; Value: 51 kOhms; ComponentLink1Description: Datasheet; ComponentLink1URL: //media.digikey.com/pdf/Data%20Sheets/KOA%20Speer/RN73R_Type_DS.pdf; ComponentLink2Description: DigiKey Link; ComponentLink2URL: http://digikey.com/product-detail/en/koa-speer-electronics-inc/RN73R2ATTD5102B25/2019-RN73R2ATTD5102B25CT-ND/9992012; Composition: Metal Film; Device Package: 0805 (2012 Metric); Features: Moisture Resistant; Height - Seated (Max): 0.024" (0.60mm); LastUpdated: 2.9.2020 01:14:33; Lifecycle Status: Active; Minimum Order: 1; Number of Terminations: 2; Operating Temperature: -55°C ~ 155°C; Package / Case: 0805 (2012 Metric); Packaging: TapeAndReel; PartId: 48095; Part Status: Active; Price: 0.07; Resistance: 51 kOhms; Series: RN73R; Size / Dimension: 0.079" L x 0.049" W (2.00mm x 1.25mm); Supplier 1: DigiKey; Supplier Part Number 1: 2019-RN73R2ATTD5102B25CT-ND; Supplier Device Package: 0805; Tolerance: ±0.1%
R29 = ERJ-6ENF4122V: RES SMD 41.2K OHM 1% 1/8W 0805; Manufacturer: Panasonic Electronic Components; Power (Watts): 0.125W, 1/8W; Temperature Coefficient: ±100ppm/°C; Part Number: ERJ-6ENF4122V; Value: 41.2 kOhms; ComponentLink1Description: Datasheet; ComponentLink1URL: https://industrial.panasonic.com/cdbs/www-data/pdf/RDA0000/AOA0000C304.pdf; ComponentLink2Description: DigiKey Link; ComponentLink2URL: http://digikey.com/product-detail/en/panasonic-electronic-components/ERJ-6ENF4122V/P41.2KCCT-ND/119439; Composition: Thick Film; Device Package: 0805 (2012 Metric); Features: Automotive AEC-Q200; Height - Seated (Max): 0.028" (0.70mm); LastUpdated: 2.9.2020 01:14:35; Lifecycle Status: Active; Minimum Order: 1; Number of Terminations: 2; Operating Temperature: -55°C ~ 155°C; Package / Case: 0805 (2012 Metric); Packaging: TapeAndReel; PartId: 47885; Part Status: Active; Price: 0.01; Ratings: AEC-Q200; Resistance: 41.2 kOhms; Series: ERJ; Size / Dimension: 0.079" L x 0.049" W (2.00mm x 1.25mm); Supplier 1: DigiKey; Supplier Part Number 1: P41.2KCCT-ND; Supplier Device Package: 0805; Tolerance: ±1%
R30 = ERA-6AEB7681V: RES 7.68K OHM 0.1% 1/8W 0805; Manufacturer: Panasonic Electronic Components; Power (Watts): 0.125W, 1/8W; Temperature Coefficient: ±25ppm/°C; Part Number: ERA-6AEB7681V; Value: 7.68 kOhms; ComponentLink1Description: Datasheet; ComponentLink1URL: https://industrial.panasonic.com/cdbs/www-data/pdf/RDM0000/AOA0000C307.pdf; ComponentLink2Description: DigiKey Link; ComponentLink2URL: http://digikey.com/product-detail/en/panasonic-electronic-components/ERA-6AEB7681V/P7.68KDACT-ND/3075246; Composition: Thin Film; Device Package: 0805 (2012 Metric); Features: Automotive AEC-Q200; Height - Seated (Max): 0.024" (0.60mm); LastUpdated: 2.9.2020 01:14:29; Lifecycle Status: Active; Minimum Order: 1; Number of Terminations: 2; Operating Temperature: -55°C ~ 155°C; Package / Case: 0805 (2012 Metric); Packaging: TapeAndReel; PartId: 48833; Part Status: Active; Price: 0.04; Ratings: AEC-Q200; Resistance: 7.68 kOhms; Series: ERA-6A; Size / Dimension: 0.079" L x 0.049" W (2.00mm x 1.25mm); Supplier 1: DigiKey; Supplier Part Number 1: P7.68KDACT-ND; Supplier Device Package: 0805; Tolerance: ±0.1%

## Sheet HalfBridge_MOSFET.SchDoc
size A4
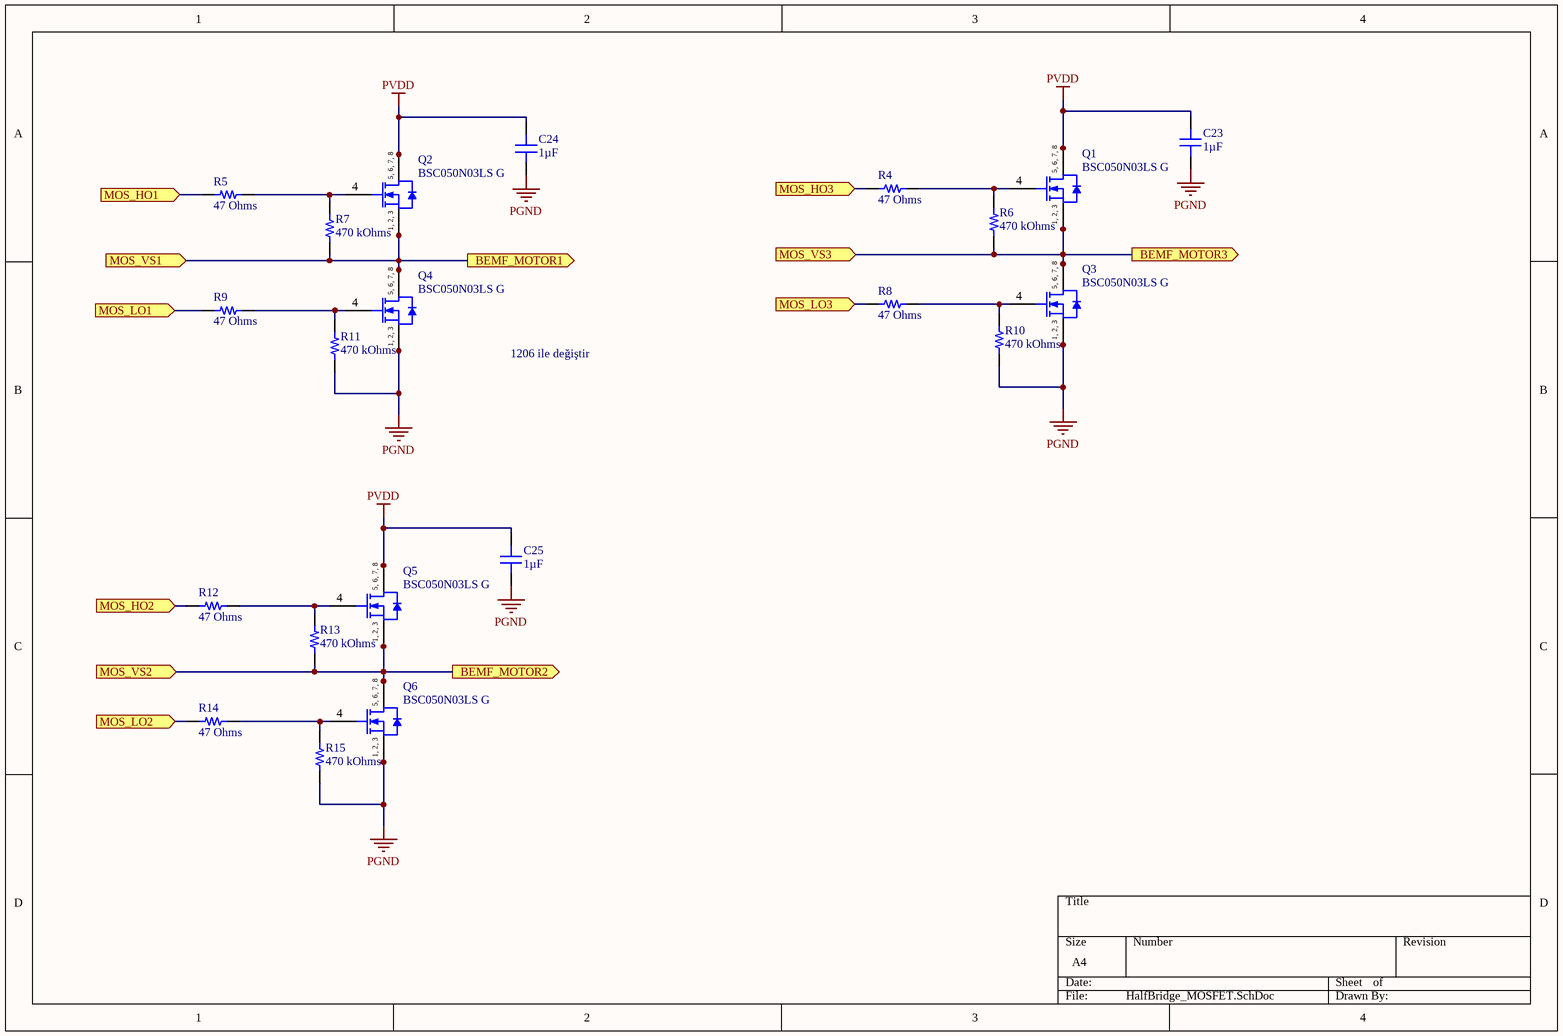
[diagram p5: HalfBridge_MOSFET.SchDoc]

### Parts
C23  1µF  [CAP 1206_3216 - 1.8MM]
C24  1µF  [CAP 1206_3216 - 1.8MM]
C25  1µF  [CAP 1206_3216 - 1.8MM]
Q1  BSC050N03LS G  [INF-PG-TDSON-8-1_V]
Q2  BSC050N03LS G  [INF-PG-TDSON-8-1_V]
Q3  BSC050N03LS G  [INF-PG-TDSON-8-1_V]
Q4  BSC050N03LS G  [INF-PG-TDSON-8-1_V]
Q5  BSC050N03LS G  [INF-PG-TDSON-8-1_V]
Q6  BSC050N03LS G  [INF-PG-TDSON-8-1_V]
R4  47 Ohms  [RES 1206_3216]
R5  47 Ohms  [RES 1206_3216]
R6  470 kOhms  [RES 1206_3216]
R7  470 kOhms  [RES 1206_3216]
R8  47 Ohms  [RES 1206_3216]
R9  47 Ohms  [RES 1206_3216]
R10  470 kOhms  [RES 1206_3216]
R11  470 kOhms  [RES 1206_3216]
R12  47 Ohms  [RES 1206_3216]
R13  470 kOhms  [RES 1206_3216]
R14  47 Ohms  [RES 1206_3216]
R15  470 kOhms  [RES 1206_3216]

### Ports
BEMF_MOTOR1 (out), BEMF_MOTOR2 (out), BEMF_MOTOR3 (out), MOS_HO1 (in), MOS_HO2 (in), MOS_HO3 (in), MOS_LO1 (in), MOS_LO2 (in), MOS_LO3 (in), MOS_VS1 (in), MOS_VS2 (in), MOS_VS3 (in)

### Nets
PGND: C23.1 C24.1 C25.1 Q3.1(SOURCE) Q3.2(SOURCE) Q3.3(SOURCE) Q4.1(SOURCE) Q4.2(SOURCE) Q4.3(SOURCE) Q6.1(SOURCE) Q6.2(SOURCE) Q6.3(SOURCE) R10.1 R11.1 R15.1
PVDD: C23.2 C24.2 C25.2 Q1.5(DRAIN) Q1.6(DRAIN) Q1.7(DRAIN) Q1.8(DRAIN) Q2.5(DRAIN) Q2.6(DRAIN) Q2.7(DRAIN) Q2.8(DRAIN) Q5.5(DRAIN) Q5.6(DRAIN) Q5.7(DRAIN) Q5.8(DRAIN)
BEMF1: Q2.1(SOURCE) Q2.2(SOURCE) Q2.3(SOURCE) Q4.5(DRAIN) Q4.6(DRAIN) Q4.7(DRAIN) Q4.8(DRAIN) R7.1 ; port MOS_VS1, port BEMF_MOTOR1
BEMF2: Q5.1(SOURCE) Q5.2(SOURCE) Q5.3(SOURCE) Q6.5(DRAIN) Q6.6(DRAIN) Q6.7(DRAIN) Q6.8(DRAIN) R13.1 ; port MOS_VS2, port BEMF_MOTOR2
BEMF3: Q1.1(SOURCE) Q1.2(SOURCE) Q1.3(SOURCE) Q3.5(DRAIN) Q3.6(DRAIN) Q3.7(DRAIN) Q3.8(DRAIN) R6.1 ; port MOS_VS3, port BEMF_MOTOR3
NetIC1_5: R9.1 ; port MOS_LO1
NetIC1_7: R5.1 ; port MOS_HO1
NetIC2_5: R14.1 ; port MOS_LO2
NetIC2_7: R12.1 ; port MOS_HO2
NetIC3_5: R8.1 ; port MOS_LO3
NetIC3_7: R4.1 ; port MOS_HO3
NetQ1_4: Q1.4(GATE) R4.2 R6.2
NetQ2_4: Q2.4(GATE) R5.2 R7.2
NetQ3_4: Q3.4(GATE) R8.2 R10.2
NetQ4_4: Q4.4(GATE) R9.2 R11.2
NetQ5_4: Q5.4(GATE) R12.2 R13.2
NetQ6_4: Q6.4(GATE) R14.2 R15.2

### Notes on the sheet
- 1206 ile değiştir
- (in symbol BSC050N03LS G_1) 5, 6, 7, 8; 1, 2, 3

### Library data of the parts
C23-C25 = HMK316B7105KLHT: CAP CER 1UF 100V X7R 1206; Manufacturer: Taiyo Yuden; Tolerance: ±10%; Part Number: HMK316B7105KLHT; Value: 1µF; Applications: Automotive; Capacitance: 1µF; ComponentLink1Description: Datasheet; ComponentLink1URL: https://www.yuden.co.jp/productdata/catalog/mlcc06_hq_e.pdf; ComponentLink2Description: DigiKey Link; ComponentLink2URL: http://digikey.com/product-detail/en/taiyo-yuden/HMK316B7105KLHT/587-6325-1-ND/9949911; Device Package: 1206 (3216 Metric); Features: High Voltage; LastUpdated: 2.9.2020 01:05:24; Lifecycle Status: Active; Minimum Order: 1; Mounting Type: Surface Mount, MLCC; Operating Temperature: -55°C ~ 125°C; Package / Case: 1206 (3216 Metric); Packaging: TapeAndReel; PartId: 22611; Part Status: Active; Price: 0.13; Ratings: AEC-Q200; Series: M; Size / Dimension: 0.126" L x 0.063" W (3.20mm x 1.60mm); Supplier 1: DigiKey; Supplier Part Number 1: 587-6325-1-ND; Temperature Coefficient: X7R; Thickness (Max): 0.071" (1.80mm); Voltage - Rated: 100V
Q1-Q6 = BSC050N03LS G_1: N-Channel OptiMOS 3 Power-MOSFET, 30 V VDS, 79 A ID, -55 to 150 degC, PG-TDSON-8-1, Reel, Green; Manufacturer: Infineon; Polarity: N; VGS(th) (min): 1Â V; RthJA (max): 50Â K/W; RDS (on) (max): 5Â mOhm; RDS (on) (max) (@4.5V): 7.5Â mOhm; RthJC (max): 2.6Â K/W; VGS(th) (max): 2.2Â V; VDS (max): 30Â V; Green: TRUE; ID (max): 79Â A; IDpuls (max): 316Â A; Ptot (max): 48Â W; QG: 13Â nC; PartNumber: BSC050N03LS G; ComponentLink1Description: Manufacturer URL; ComponentLink2Description: Datasheet; DatasheetVersion: Rev. 1.6; ComponentLink3URL: http://www.infineon.com/cms/packages/SMD_-_Surface_Mounted_Devices/P-PG-TDSON/P-PG-TDSON-08-01x_2x_3.html?__locale=en; ComponentLink1URL: http://www.infineon.com/; Packing: Reel; ComponentLink2URL: http://www.infineon.com/dgdl/BSC050N03LS_rev1.6.pdf?folderId=db3a304412b407950112b408e8c90004&fileId=db3a304412b407950112b4276b953c2b; ComponentLink3Description: Package Specification; Rth: 2.6Â K/W; Halogen-free: TRUE; Mounting Technology: Surface Mount; PackageReference: PG-TDSON-8-1; PackageDescription: 8-Pin Plastic (Green) Thin Dual Small Outline Non-Leaded Package, 5.15 x 5.9 mm Body, 1.27 mm Pitch
R4 R5 R8 R9 R12 R14 = CRCW120647R0JNEAIF: RES SMD 47 OHM 5% 1/4W 1206; Manufacturer: Vishay Dale; Power (Watts): 0.25W, 1/4W; Temperature Coefficient: ±200ppm/°C; Part Number: CRCW120647R0JNEAIF; ComponentLink1Description: Datasheet; ComponentLink1URL: http://www.vishay.com/docs/20024/dcrcwife3.pdf; ComponentLink2Description: DigiKey Link; ComponentLink2URL: http://digikey.com/product-detail/en/vishay-dale/CRCW120647R0JNEAIF/541-47ARCT-ND/3477236; Composition: Thick Film; Device Package: 1206 (3216 Metric); Features: Automotive AEC-Q200, Pulse Withstanding; Height - Seated (Max): 0.024" (0.60mm); LastUpdated: 2.9.2020 01:12:26; Lifecycle Status: Active; Minimum Order: 1; Number of Terminations: 2; Operating Temperature: -55°C ~ 155°C; Package / Case: 1206 (3216 Metric); Packaging: TapeAndReel; PartId: 45398; Part Status: Active; Price: 0.10; Ratings: AEC-Q200; Resistance: 47 Ohms; Series: CRCW-IF; Size / Dimension: 0.126" L x 0.063" W (3.20mm x 1.60mm); Supplier 1: DigiKey; Supplier Part Number 1: 541-47ARCT-ND; Supplier Device Package: 1206; Tolerance: ±5%; Value: 47 Ohms
R6 R7 R10 R11 R13 R15 = CRCW1206470KFKEA: RES SMD 470K OHM 1% 1/4W 1206; Manufacturer: Vishay Dale; Power (Watts): 0.25W, 1/4W; Temperature Coefficient: ±100ppm/°C; Part Number: CRCW1206470KFKEA; ComponentLink1Description: Datasheet; ComponentLink1URL: http://www.vishay.com/docs/20035/dcrcwe3.pdf; ComponentLink2Description: DigiKey Link; ComponentLink2URL: http://digikey.com/product-detail/en/vishay-dale/CRCW1206470KFKEA/541-470KFCT-ND/1182064; Composition: Thick Film; Device Package: 1206 (3216 Metric); Features: Automotive AEC-Q200; Height - Seated (Max): 0.024" (0.60mm); LastUpdated: 2.9.2020 01:12:24; Lifecycle Status: Active; Minimum Order: 1; Number of Terminations: 2; Operating Temperature: -55°C ~ 155°C; Package / Case: 1206 (3216 Metric); Packaging: TapeAndReel; PartId: 45814; Part Status: Active; Price: 0.01; Ratings: AEC-Q200; Resistance: 470 kOhms; Series: CRCW; Size / Dimension: 0.126" L x 0.063" W (3.20mm x 1.60mm); Supplier 1: DigiKey; Supplier Part Number 1: 541-470KFCT-ND; Supplier Device Package: 1206; Tolerance: ±1%; Value: 470 kOhms

## Nets that join several sheets
GND: Microcontroller (20 pins), MosfetDriver (6 pins), BEMF_Sense (R22.1 R23.1 R24.1), Power (10 pins)
PGND: Power (J3.2), HalfBridge_MOSFET (15 pins)
PVDD: Microcontroller (R33.2), MosfetDriver (9 pins), Power (5 pins), HalfBridge_MOSFET (15 pins)
VCC: Microcontroller (13 pins), Power (5 pins)
BEMF1: MosfetDriver (C5.1 IC1.6), BEMF_Sense (R17.2), HalfBridge_MOSFET (8 pins)
BEMF2: MosfetDriver (C11.1 IC2.6), BEMF_Sense (R19.2), HalfBridge_MOSFET (8 pins)
BEMF3: MosfetDriver (C20.1 IC3.6), BEMF_Sense (R21.2), HalfBridge_MOSFET (8 pins)
BEMF_Out1: Microcontroller (U1.25), BEMF_Sense (R20.2 R21.1 R22.2)
BEMF_Out2: Microcontroller (U1.24), BEMF_Sense (R18.2 R19.1 R23.2)
BEMF_Out3: Microcontroller (U1.23), BEMF_Sense (R16.2 R17.1 R24.2)
HIN1: Microcontroller (J4.4 U1.15), MosfetDriver (IC1.2)
HIN2: Microcontroller (U1.14), MosfetDriver (IC2.2)
HIN3: Microcontroller (U1.13), MosfetDriver (IC3.2)
LIN1: Microcontroller (U1.11), MosfetDriver (IC1.3)
LIN2: Microcontroller (U1.9), MosfetDriver (IC2.3)
LIN3: Microcontroller (U1.1), MosfetDriver (IC3.3)
NetIC1_5: MosfetDriver (IC1.5), HalfBridge_MOSFET (R9.1)
NetIC1_7: MosfetDriver (IC1.7), HalfBridge_MOSFET (R5.1)
NetIC2_5: MosfetDriver (IC2.5), HalfBridge_MOSFET (R14.1)
NetIC2_7: MosfetDriver (IC2.7), HalfBridge_MOSFET (R12.1)
NetIC3_5: MosfetDriver (IC3.5), HalfBridge_MOSFET (R8.1)
NetIC3_7: MosfetDriver (IC3.7), HalfBridge_MOSFET (R4.1)
VGND: Microcontroller (U1.10), BEMF_Sense (R16.1 R18.1 R20.1)